# EAGLE design RPi_SPI_inputs_v03 (EAGLE 7.2.0)
AUTHOR: M.Petrilak; VERSION: 03
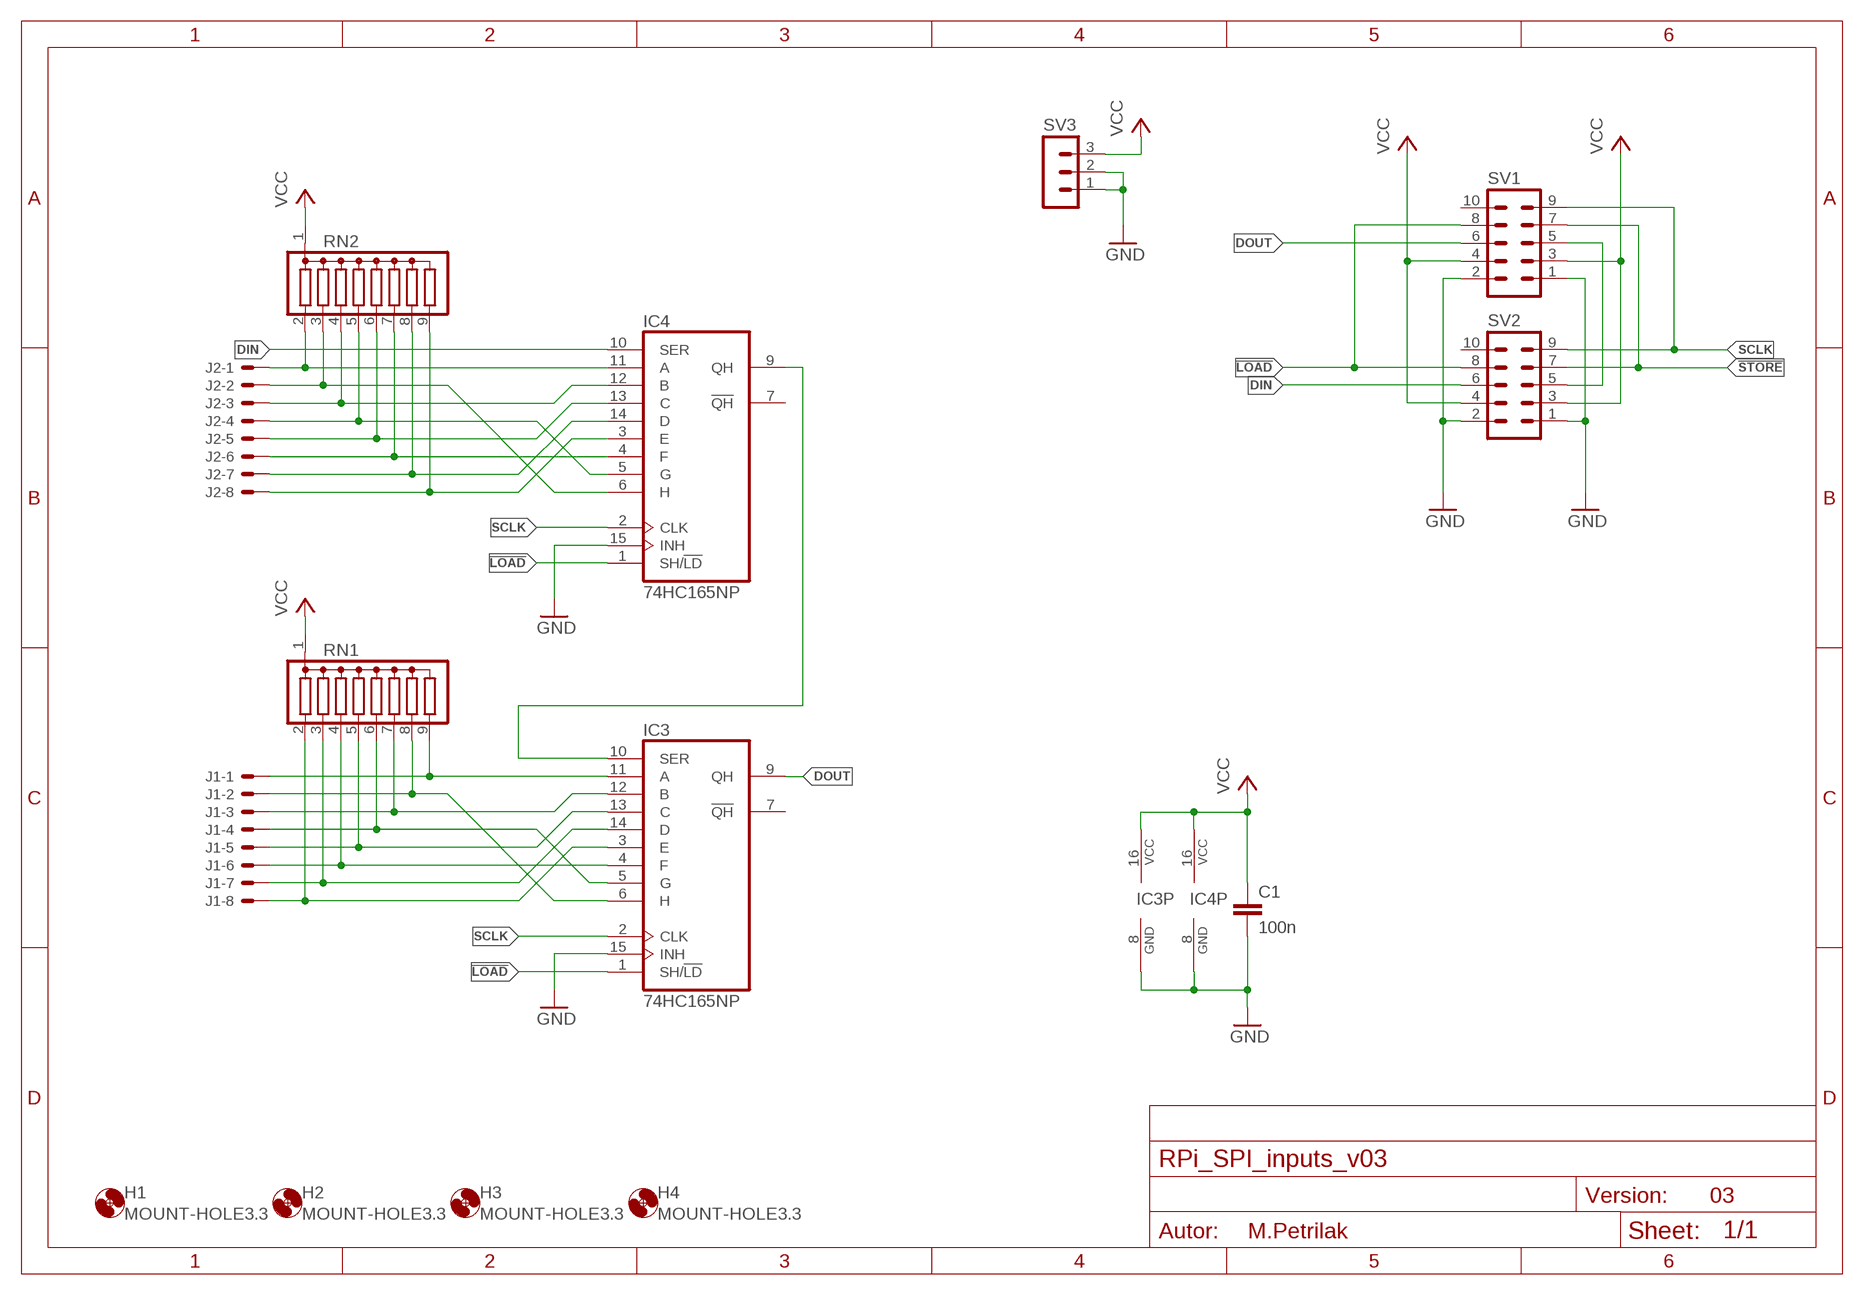
[diagram p0: schematic, sheet 1]

## Parts
C1  100n  C-EUC1206  [C1206]
H1  MOUNT-HOLE3.3  [3,3]
H2  MOUNT-HOLE3.3  [3,3]
H3  MOUNT-HOLE3.3  [3,3]
H4  MOUNT-HOLE3.3  [3,3]
IC3  74HC165NP  [SOCKET-16]
IC4  74HC165NP  [SOCKET-16]
J1  22-05-7088-SPEC-08  [7395-08_SPEC]
J2  22-05-7088-SPEC-08  [7395-08_SPEC]
RN1  G08R  [SIL9]
RN2  G08R  [SIL9]
SV1  ML10  [ML10]
SV2  ML10  [ML10]
SV3  MA03-1_NO  [MA03-1_NO]

## Nets
!LOAD: IC3.1(SH/!LD) IC4.1(SH/!LD) SV1.8 SV2.8
!STORE: SV1.7 SV2.7
DIN: IC4.10(SER) SV2.6
DOUT: IC3.9(QH) SV1.6
DRET: SV1.5 SV2.5
GND: C1.2 IC3.8(GND) IC3.15(INH) IC4.8(GND) IC4.15(INH) SV1.1 SV1.2 SV2.1 SV2.2 SV3.1 SV3.2
N$1: IC4.3(E) J2.8 RN2.9
N$2: IC4.14(D) J2.7 RN2.8
N$3: IC3.10(SER) IC4.9(QH)
N$4: IC4.4(F) J2.6 RN2.7
N$5: IC4.13(C) J2.5 RN2.6
N$6: IC4.5(G) J2.4 RN2.5
N$7: IC4.12(B) J2.3 RN2.4
N$8: IC4.6(H) J2.2 RN2.3
N$9: IC4.11(A) J2.1 RN2.2
N$22: IC3.11(A) J1.1 RN1.9
N$23: IC3.6(H) J1.2 RN1.8
N$24: IC3.12(B) J1.3 RN1.7
N$25: IC3.5(G) J1.4 RN1.6
N$26: IC3.13(C) J1.5 RN1.5
N$27: IC3.4(F) J1.6 RN1.4
N$28: IC3.14(D) J1.7 RN1.3
N$29: IC3.3(E) J1.8 RN1.2
SCLK: IC3.2(CLK) IC4.2(CLK) SV1.9 SV2.9
VCC: C1.1 IC3.16(VCC) IC4.16(VCC) RN1.1 RN2.1 SV1.3 SV1.4 SV2.3 SV2.4 SV3.3
Unconnected: IC3.7(!QH) IC4.7(!QH) SV1.10 SV2.10

## Library data of the parts
C1 = rcl:C-EU: CAPACITOR, European symbol
H1-H4 = holes:MOUNT-HOLE: MOUNTING HOLE with drill center marker
IC3 IC4 = 74xx-us:74*165: 8-bit parallel load SHIFT REGISTER
J1 J2 = con-molex:22-?-08: CONNECTOR wire to board 2.54 mm (.1 inch) pitch header
RN1 RN2 = resistor-sil:G08R: SIL RESISTOR
SV1 SV2 = con-harting-ml:ML10: HARTING
SV3 = con-lstb:MA03-1: PIN HEADER

## Board
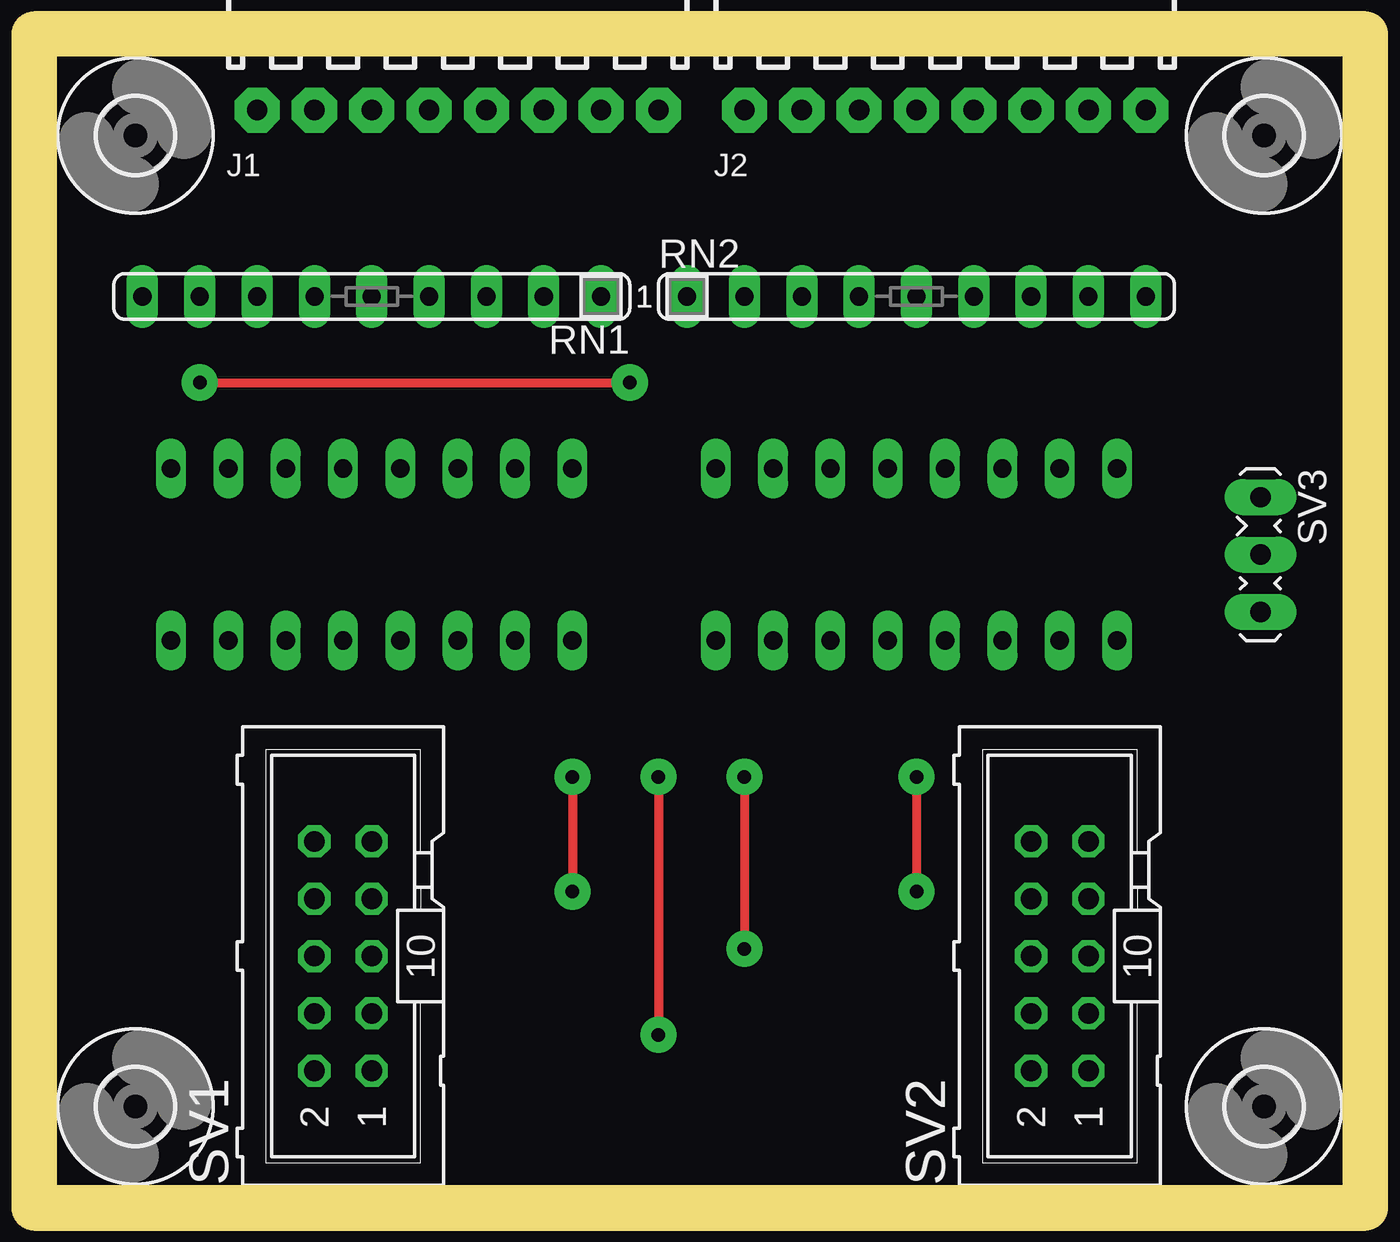
[diagram p1: board, top side]
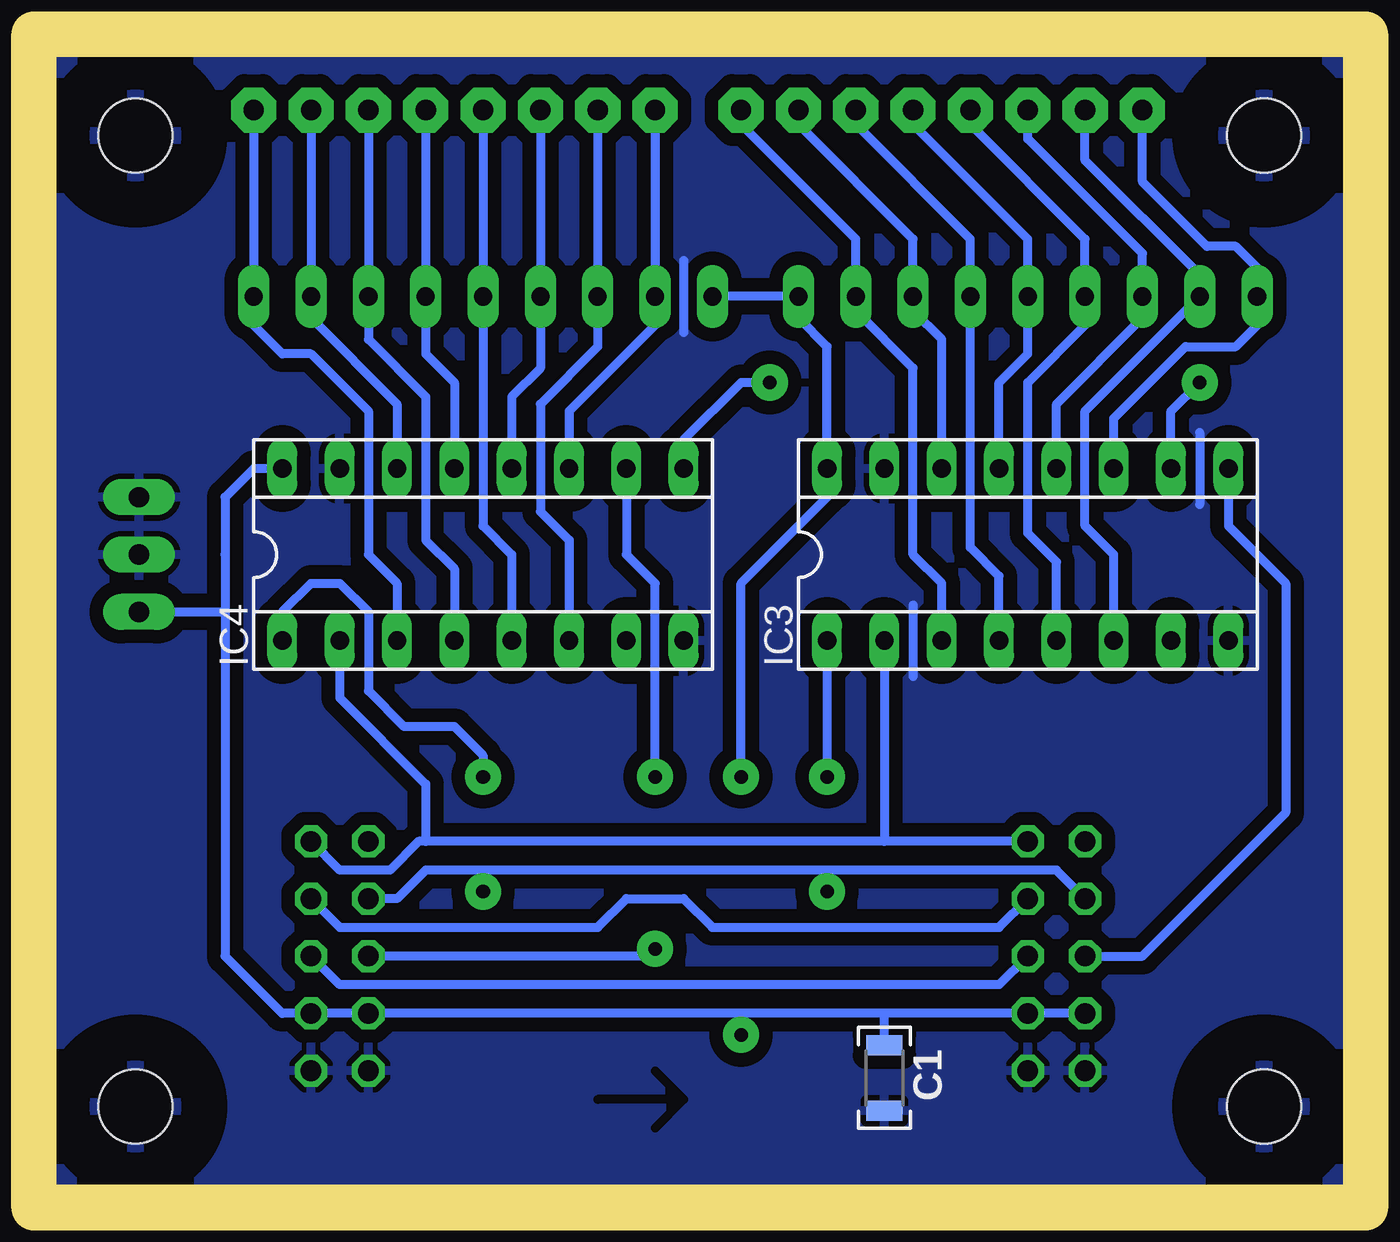
[diagram p2: board, bottom side, seen from below]

Size 57 x 50 mm. Coordinates in mm from the lower left corner, seen from the top.
Outline: 0,0 57,0 57,50 0,50 0,0
Copper layers (1*16): Top 0.035mm / dielectric 1.5mm / Bottom 0.035mm
Design rules "Michal_CNC_doma": minimum track width 0.3mm, minimum drill 0.6mm, track to track 0.6mm, track to pad 0.6mm, pad to pad 0.4mm, via to via 0.4mm, smd to smd 8mil, copper to edge 1mil, drill to drill 8mil, minimum pad ring 10mil, minimum via ring 8mil, stop-mask expansion 4mil, vias tented up to drill 0mil, thermal gap 10mil
bRestrict: 3 lines
Milling: 4 lines

### Footprints (pad centres in the part's own frame; a part is rotated, then mirrored left to right if it is on the bottom)
C1206 = smd 0.9 x 1.6: 1 -1.45,0; 2 1.45,0
3,3 = hole 3.3: 0,0
SOCKET-16 = drill 0.813 long: 1 -8.89,-3.81; 2 -6.35,-3.81; 3 -3.81,-3.81; 4 -1.27,-3.81; 5 1.27,-3.81; 6 3.81,-3.81; 7 6.35,-3.81; 8 8.89,-3.81; 9 8.89,3.81; 10 6.35,3.81; 11 3.81,3.81; 12 1.27,3.81; 13 -1.27,3.81; 14 -3.81,3.81; 15 -6.35,3.81; 16 -8.89,3.81
7395-08_SPEC = drill 0.9 pad 2 octagon: 1 8.89,0; 2 6.35,0; 3 3.81,0; 4 1.27,0; 5 -1.27,0; 6 -3.81,0; 7 -6.35,0; 8 -8.89,0
SIL9 = drill 0.8 pad 1.4 long: 1 -10.16,0; 2 -7.62,0; 3 -5.08,0; 4 -2.54,0; 5 0,0; 6 2.54,0; 7 5.08,0; 8 7.62,0; 9 10.16,0
ML10 = drill 0.914 octagon: 1 -5.08,-1.27; 2 -5.08,1.27; 3 -2.54,-1.27; 4 -2.54,1.27; 5 0,-1.27; 6 0,1.27; 7 2.54,-1.27; 8 2.54,1.27; 9 5.08,-1.27; 10 5.08,1.27
MA03-1_NO = drill 0.9 pad 1.6 long: 1 -2.54,0; 2 0,0; 3 2.54,0

### Placement (x,y rotation side)
C1  20.32,4.76 270 bottom
H1  3.5,3.5 0 top
H2  53.5,3.5 0 top
H3  53.5,46.5 0 top
H4  3.5,46.5 0 top
IC3  13.97,27.94 0 bottom
IC4  38.1,27.94 0 bottom
J1  17.78,47.62 180 top
J2  39.37,47.62 180 top
RN1  13.97,39.37 180 top
RN2  38.1,39.37 0 top
SV1  12.7,10.16 90 top
SV2  44.45,10.16 90 top
SV3  53.34,27.94 270 top

### Tracks (layer width: path | path; a pad name or v marks a point on that pad's centre or on a via)
!LOAD  (via drill 0.6 pad 1.6)
  Top 0.406: v22.86,18.1 v22.86,13.02 | v38.1,18.1 v38.1,13.02
  Bottom 0.406: SV1.8 12.7,13.97 22.86,13.97 | 22.86,13.97 38.1,13.97 | 38.1,13.97 40.64,13.97 41.91,12.7 SV2.8 | IC3.1 v22.86,18.1 | v22.86,13.02 22.86,13.97 | v38.1,18.1 38.1,19.05 39.37,20.32 41.59,20.32 43.18,21.91 43.18,25.4 44.45,26.67 45.72,26.67 46.99,25.4 IC4.1 | v38.1,13.02 38.1,13.97
!STORE
  Bottom 0.406: SV2.7 44.45,11.43 33.02,11.43 31.75,12.7 29.21,12.7 27.94,11.43 15.24,11.43 SV1.7
DIN  (via drill 0.6 pad 1.6)
  Top 0.406: v30.48,18.1 v30.48,10.48
  Bottom 0.406: IC4.10 31.75,27.94 30.48,26.67 v30.48,18.1 | v30.48,10.48 30.8,10.16 SV2.6
DOUT
  Bottom 0.406: SV1.6 8.89,10.16 2.54,16.51 2.54,26.67 5.08,29.21 IC3.9
DRET
  Bottom 0.406: SV1.5 15.24,8.89 44.45,8.89 SV2.5
GND
  Bottom 0.406: 6.35,33.34 6.35,30.16 | 19.05,25.72 19.05,22.54 | 29.21,40.96 29.21,37.78
  pour Bottom: 0,0 57,0 57,50 0,50
N$1
  Bottom 0.406: J2.8 RN2.9 48.26,38.1 46.99,36.83 45.72,36.83 43.18,34.29 43.18,27.94 41.91,26.67 IC4.3
N$2
  Bottom 0.406: J2.7 RN2.8 45.72,38.42 41.91,34.61 IC4.14
N$3  (via drill 0.6 pad 1.6)
  Top 0.406: v6.35,35.56 v25.4,35.56
  Bottom 0.406: IC3.10 7.62,34.29 v6.35,35.56 | v25.4,35.56 26.67,35.56 29.21,33.02 IC4.9
N$4
  Bottom 0.406: J2.6 RN2.7 43.18,37.47 40.64,34.92 40.64,28.57 39.37,27.3 IC4.4
N$5
  Bottom 0.406: J2.5 RN2.6 40.64,36.83 39.37,35.56 IC4.13
N$6
  Bottom 0.406: J2.4 RN2.5 38.1,29.21 36.83,27.94 IC4.5
N$7
  Bottom 0.406: J2.3 RN2.4 35.56,36.2 36.83,34.92 IC4.12
N$8
  Bottom 0.406: J2.2 RN2.3 33.02,37.15 35.56,34.61 35.56,29.84 34.29,28.57 IC4.6
N$9
  Bottom 0.406: J2.1 RN2.2 30.48,38.1 34.29,34.29 IC4.11
N$22
  Bottom 0.406: IC3.11 10.16,33.97 6.99,37.15 4.76,37.15 3.81,38.1 RN1.9 3.81,40.64 4.76,41.59 6.03,41.59 8.89,44.45 J1.1
N$23
  Bottom 0.406: IC3.6 10.16,27.94 11.43,29.21 11.43,34.29 RN1.8 6.35,40.32 11.43,45.4 J1.2
N$24
  Bottom 0.406: IC3.12 12.7,34.61 8.89,38.42 RN1.7 8.89,41.27 13.97,46.35 J1.3
N$25
  Bottom 0.406: IC3.5 12.7,27.62 13.97,28.89 13.97,35.56 11.43,38.1 RN1.6 11.43,41.91 16.51,46.99 J1.4
N$26
  Bottom 0.406: IC3.13 15.24,35.56 13.97,36.83 RN1.5 13.97,41.91 19.05,46.99 J1.5
N$27
  Bottom 0.406: IC3.4 15.24,26.99 16.51,28.26 RN1.4 16.51,41.91 21.59,46.99 J1.6
N$28
  Bottom 0.406: IC3.14 17.78,37.47 19.05,38.73 RN1.3 19.05,41.91 24.13,46.99 J1.7
N$29
  Bottom 0.406: IC3.3 17.78,26.67 19.05,27.94 19.05,36.2 21.59,38.73 RN1.2 21.59,41.91 26.67,46.99 J1.8
SCLK
  Bottom 0.406: SV1.9 20.32,15.24 | 20.32,15.24 40.64,15.24 | 40.64,15.24 40.96,15.24 42.23,13.97 44.45,13.97 SV2.9 | IC3.2 20.32,15.24 | IC4.2 44.45,21.59 40.64,17.78 40.64,15.24
VCC  (via drill 0.6 pad 1.6)
  Top 0.406: v26.67,18.1 v26.67,6.67
  Bottom 0.406: SV1.4 SV1.3 20.32,7.62 | 20.32,7.62 26.67,7.62 | 26.67,7.62 SV2.4 SV2.3 46.99,7.62 49.53,10.16 49.53,25.4 | C1.1 20.32,7.62 | IC4.16 48.26,31.75 49.53,30.48 49.53,27.94 49.53,25.4 | SV3.3 49.53,25.4 | v26.67,18.1 26.67,26.67 22.86,30.48 IC3.16 22.86,37.15 24.13,38.42 RN1.1 RN2.1 | v26.67,6.67 26.67,7.62